# Altium project PCB Robot.PrjPCB
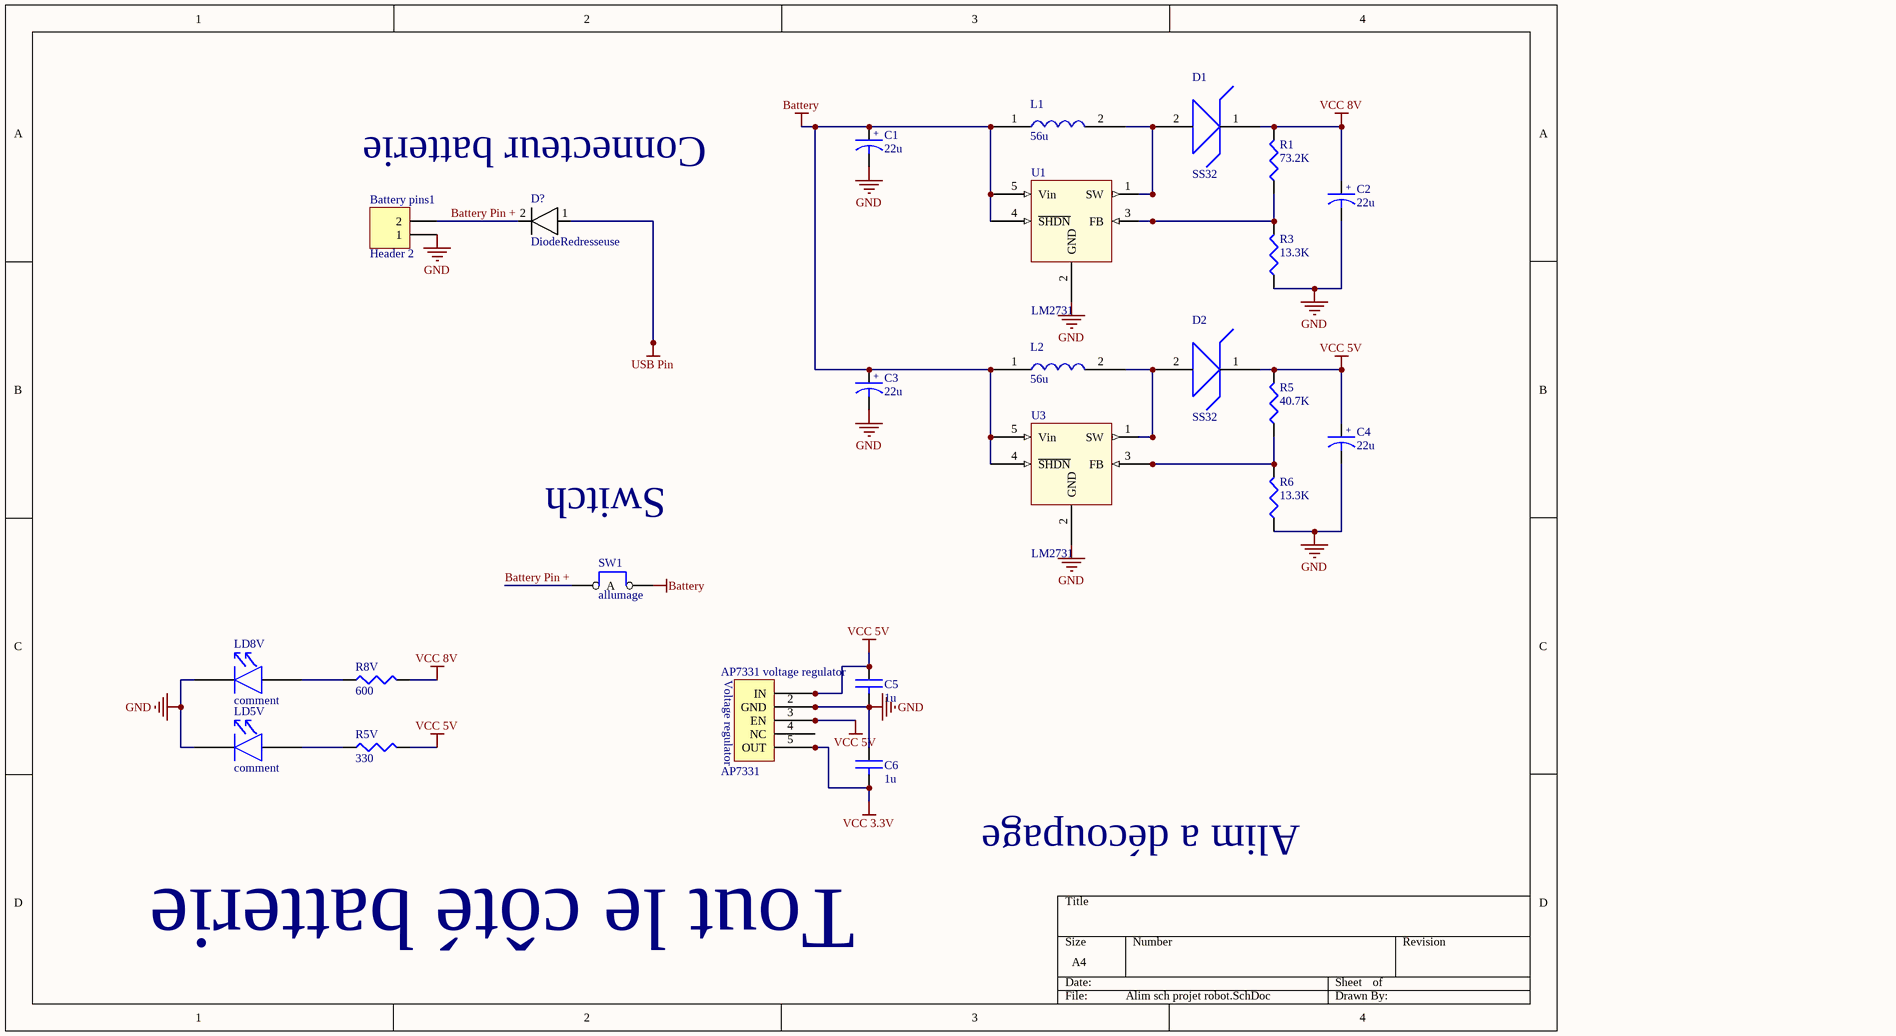
[diagram p0: Alim sch projet robot.SchDoc]
10 sheets, 124 parts. Net scope: flat (ports and power ports of the same name join across sheets).
Board file: PCB robot V3.2.PCBDOC
Sheets:
  Alim sch projet robot.SchDoc
  Schema chargeur USB projet robot.SchDoc
  CarteTxCapteurDistance 2.SchDoc
  CarteTxMoteur.SchDoc
  IA Core.SchDoc
  TXRobot-Boutons.SchDoc
  LED Matrix connector.SchDoc
  Sound Connector.SchDoc
  Wi fi connector.SchDoc
  Line driver connector.SchDoc

## Sheet Alim sch projet robot.SchDoc
size A4; PageSetup: Record=PageOptions|CenterHorizontal=True|CenterVertical=True|PrintScale=1.42|XCorrection=1.00|YCorrection=1.00|PrintKind=0|BorderSize=5000000|LeftOffset=0|BottomOffset=0|Orientation=2|PaperLength=1000|PaperWidth=1000|Scale=100|PaperSource=7|PrintQuality=-4|MediaType=1|DitherType=10|PaperKind=A3|PrintScaleMode=1

### Parts
AP7331_voltage_regulator  AP7331  [AP7331]
Battery_pins1  Header 2  [HDR1X2]
C1  value 22u  [293D/B]  (hidden comment: CAP_POL)
C2  value 22u  [293D/B]  (hidden comment: CAP_POL)
C3  value 22u  [293D/B]  (hidden comment: CAP_POL)
C4  value 22u  [293D/B]  (hidden comment: CAP_POL)
C5  value 1u  [0805]  (hidden comment: CAP)
C6  value 1u  [0805]  (hidden comment: CAP)
D1  SS32  [Schottly Diode SS32 footprint]
D2  SS32  [Schottly Diode SS32 footprint]
D?  DiodeRedresseuse  [Diode MULTICOMP SS16]
L1  value 56u  [1050]  (hidden comment: IND)
L2  value 56u  [1050]  (hidden comment: IND)
LD5V  comment  [LED1206]
LD8V  comment  [LED1206]
R1  value 73.2K  [0805]  (hidden comment: RES)
R3  value 13.3K  [0805]  (hidden comment: RES)
R5  value 40.7K  [0805]  (hidden comment: RES)
R5V  value 330  [0805]  (hidden comment: RES)
R6  value 13.3K  [0805]  (hidden comment: RES)
R8V  value 600  [0805]  (hidden comment: RES)
SW1  allumage  [JMP2-100]
U1  LM2731  [LM2731 footprint]
U3  LM2731  [LM2731 footprint]

### Nets
Battery: C1.1 C3.1 L1.1 L2.1 SW1.2(com) U1.4(~{SHDN}) U1.5(Vin) U3.4(~{SHDN}) U3.5(Vin)
GND: AP7331_voltage_regulator.2(GND) Battery_pins1.1 C1.2 C2.2 C3.2 C4.2 C5.2 C6.1 LD5V.K LD8V.K R3.1 R6.1 U1.2(GND) U3.2(GND)
USB Pin: D?.1
VCC 3.3V: AP7331_voltage_regulator.5(OUT) C6.2
VCC 5V: AP7331_voltage_regulator.1(IN) AP7331_voltage_regulator.3(EN) C4.1 C5.1 D2.1(Cathode_(+)) R5.2 R5V.2
VCC 8V: C2.1 D1.1(Cathode_(+)) R1.2 R8V.2
Battery Pin +: Battery_pins1.2 D?.2 SW1.1(A)
NetD1_2: D1.2(Anode_(-)) L1.2 U1.1(SW)
NetD2_2: D2.2(Anode_(-)) L2.2 U3.1(SW)
NetLD5V_A: LD5V.A R5V.1
NetLD8V_A: LD8V.A R8V.1
NetR1_1: R1.1 R3.2 U1.3(FB)
NetR5_1: R5.1 R6.2 U3.3(FB)

Not connected (* = marked no-connect by the designer): AP7331_voltage_regulator 4(NC)

### Notes on the sheet
- Connecteur batterie
- Switch
- Alim a découpage
- Tout le côté batterie
- (in symbol AP7331) Voltage regulator
- (in symbol CAP_POL) +

### Library data of the parts
Battery_pins1 = Header 2: Header, 2-Pin; LatestRevisionDate: 17-Jul-2002; LatestRevisionNote: Re-released for DXP Platform.; Publisher: Altium Limited
C1-C4 = CAP_POL: capacité polarisée
C5 C6 = CAP: capacité non polarisée
D1 D2 = SS32: Schottky Diode 20V 3A
L1 L2 = Shielded inductor: Shielded Inductor 1050
LD5V LD8V = LED: LED 5mm/3mm/CMS
R1 R3 R5 R5V R6 R8V = RES: resistance
SW1 = JUMPER2: cavalier 1 position
U1 U3 = LM2731: Boost switch regulator DCDC

## Sheet Schema chargeur USB projet robot.SchDoc
size A4; PageSetup: Record=PageOptions|CenterHorizontal=True|CenterVertical=True|PrintScale=1.42|XCorrection=1.00|YCorrection=1.00|PrintKind=0|BorderSize=5000000|LeftOffset=0|BottomOffset=0|Orientation=2|PaperLength=1000|PaperWidth=1000|Scale=100|PaperSource=7|PrintQuality=-4|MediaType=1|DitherType=10|PaperKind=A3|PrintScaleMode=1
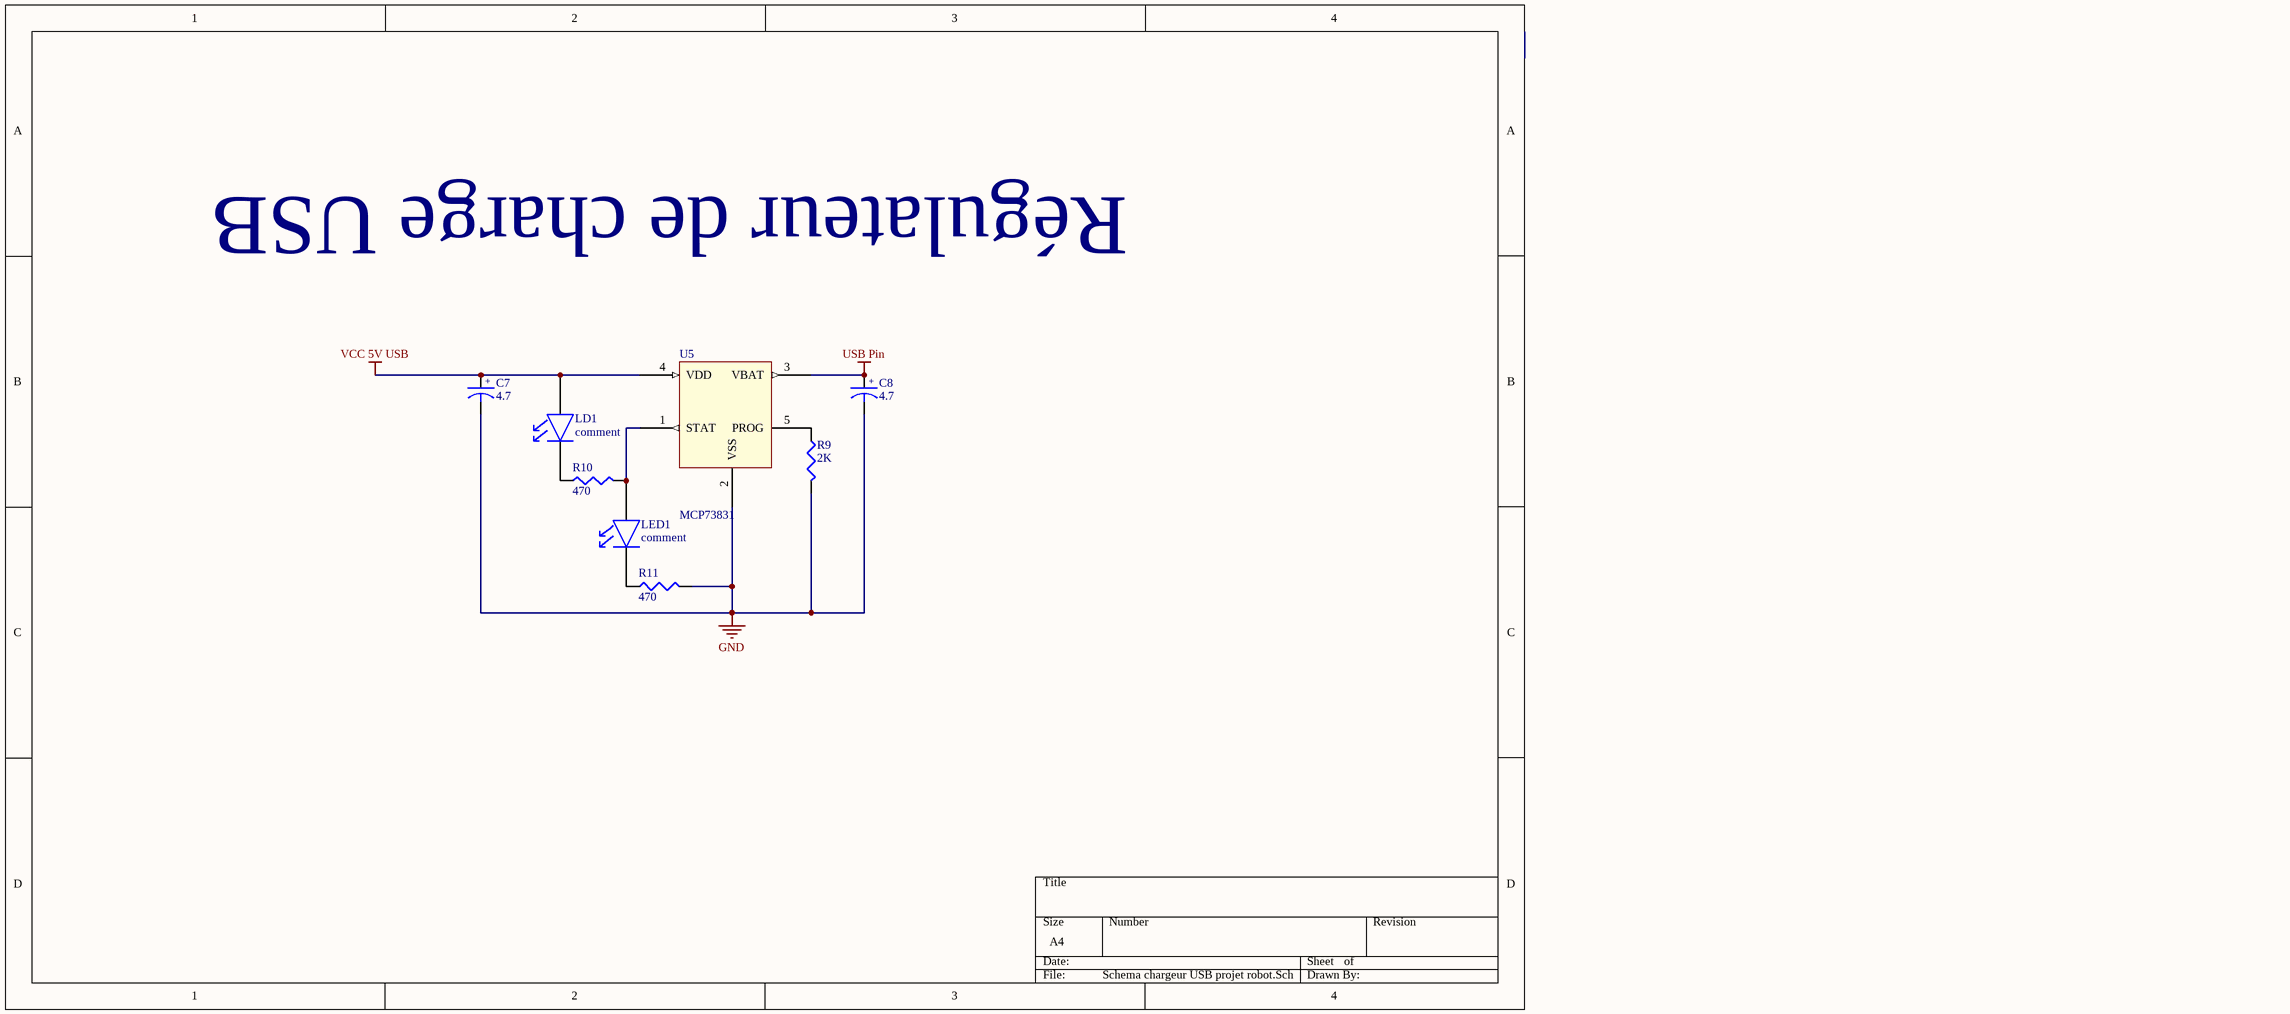
[diagram p1: Schema chargeur USB projet robot.SchDoc]

### Parts
C7  value 4.7  [293D/B]  (hidden comment: CAP_POL)
C8  value 4.7  [293D/B]  (hidden comment: CAP_POL)
LD1  comment  [LED0805]
LED1  comment  [LED0805]
R9  value 2K  [0805]  (hidden comment: RES)
R10  value 470  [0805]  (hidden comment: RES)
R11  value 470  [0805]  (hidden comment: RES)
U5  MCP73831  [MCP73831]

### Nets
GND: C7.2 C8.2 R9.2 R11.2 U5.2(VSS)
USB Pin: C8.1 U5.3(VBAT)
VCC 5V USB: C7.1 LD1.A U5.4(VDD)
NetLD1_K: LD1.K R10.1
NetLED1_A: LED1.A R10.2 U5.1(STAT)
NetLED1_K: LED1.K R11.1
NetR9_1: R9.1 U5.5(PROG)

### Notes on the sheet
- Régulateur de charge USB
- (in symbol CAP_POL) +

### Library data of the parts
C7 C8 = CAP_POL: capacité polarisée
LD1 LED1 = LED: LED 5mm/3mm/CMS
R9-R11 = RES: resistance
U5 = MCP73831: Voltage regulator for Li-po or li-ion battery, USB compatible

## Sheet CarteTxCapteurDistance 2.SchDoc
size A3; PageSetup: Record=PageOptions|CenterHorizontal=True|CenterVertical=True|PrintScale=1.04|XCorrection=1.00|YCorrection=1.00|PrintKind=0|BorderSize=5000000|LeftOffset=0|BottomOffset=0|Orientation=2|PaperLength=1000|PaperWidth=1000|Scale=100|PaperSource=7|PrintQuality=-4|MediaType=1|DitherType=10|PaperKind=A3|PrintScaleMode=1
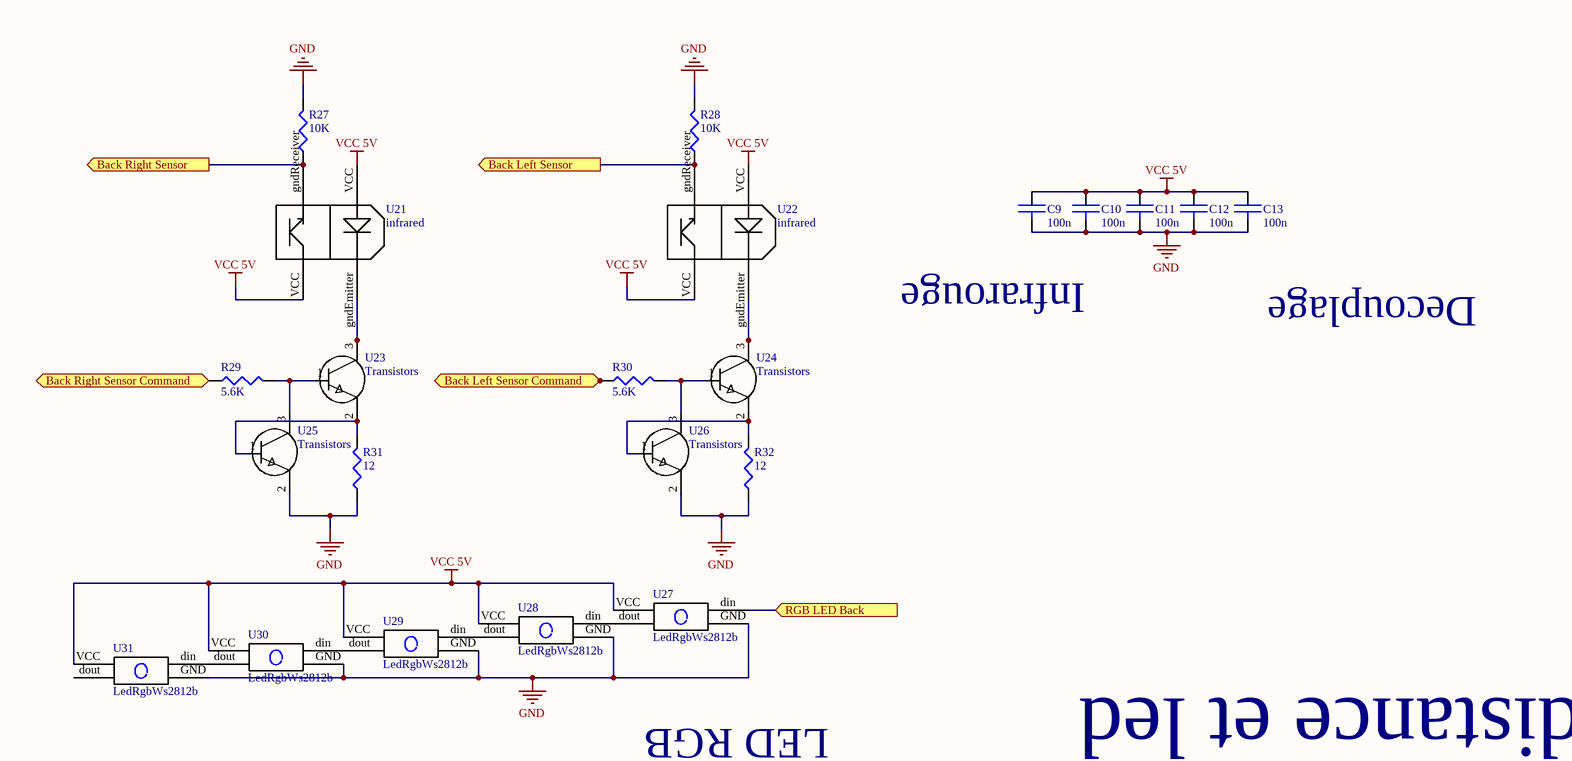
[diagram p2: CarteTxCapteurDistance 2.SchDoc, left]
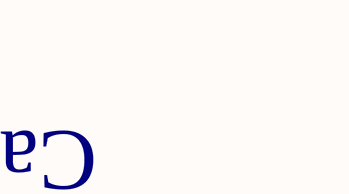
[diagram p3: CarteTxCapteurDistance 2.SchDoc, right]

### Parts
C9  value 100n  [0805]  (hidden comment: CAP)
C10  value 100n  [0805]  (hidden comment: CAP)
C11  value 100n  [0805]  (hidden comment: CAP)
C12  value 100n  [0805]  (hidden comment: CAP)
C13  value 100n  [0805]  (hidden comment: CAP)
R27  value 10K  [0805]  (hidden comment: RES)
R28  value 10K  [0805]  (hidden comment: RES)
R29  value 5.6K  [0805]  (hidden comment: RES)
R30  value 5.6K  [0805]  (hidden comment: RES)
R31  value 12  [0805]  (hidden comment: RES)
R32  value 12  [0805]  (hidden comment: RES)
U21  infrared  [Infrared]
U22  infrared  [Infrared]
U23  Transistors  [BC817-40]
U24  Transistors  [BC817-40]
U25  Transistors  [BC817-40]
U26  Transistors  [BC817-40]
U27  LedRgbWs2812b  [LedRgbWs2812b]
U28  LedRgbWs2812b  [LedRgbWs2812b]
U29  LedRgbWs2812b  [LedRgbWs2812b]
U30  LedRgbWs2812b  [LedRgbWs2812b]
U31  LedRgbWs2812b  [LedRgbWs2812b]

### Ports
Back Left Sensor (out), Back Left Sensor Command (in), Back Right Sensor (out), Back Right Sensor Command (in), RGB LED Back (in)

### Nets
GND: C9.2 C10.2 C11.2 C12.2 C13.2 R27.2 R28.2 R31.1 R32.1 U25.2(Emi) U26.2(Emi) U27.GND U28.GND U29.GND U30.GND U31.GND
VCC 5V: C9.1 C10.1 C11.1 C12.1 C13.1 U21.VCC U22.VCC U27.VCC U28.VCC U29.VCC U30.VCC U31.VCC
NetMicroController1_35: R30.1 ; port Back Left Sensor Command
NetMicroController1_37: R29.1 ; port Back Right Sensor Command
NetMicroController1_40: U27.din ; port RGB LED Back
NetMicroController1_82: R28.1 U22.gndReceiver ; port Back Left Sensor
NetMicroController1_83: R27.1 U21.gndReceiver ; port Back Right Sensor
NetR29_2: R29.2 U23.1(Base) U25.3(Co)
NetR30_2: R30.2 U24.1(Base) U26.3(Co)
NetR31_2: R31.2 U23.2(Emi) U25.1(Base)
NetR32_2: R32.2 U24.2(Emi) U26.1(Base)
NetU21_gndEmitter: U21.gndEmitter U23.3(Co)
NetU22_gndEmitter: U22.gndEmitter U24.3(Co)
NetU27_dout: U27.dout U28.din
NetU28_dout: U28.dout U29.din
NetU29_dout: U29.dout U30.din
NetU30_dout: U30.dout U31.din

Not connected (* = marked no-connect by the designer): U31 dout

### Notes on the sheet
- Infrarouge
- Decouplage
- LED RGB
- Capteur distance et led

### Library data of the parts
C9-C13 = CAP: capacité non polarisée
R27-R32 = RES: resistance
U21 U22 = RPR-359F
U23-U26 = Transistors: NPN transistor

## Sheet CarteTxMoteur.SchDoc
size A4; PageSetup: Record=PageOptions|CenterHorizontal=True|CenterVertical=True|PrintScale=1.42|XCorrection=1.00|YCorrection=1.00|PrintKind=0|BorderSize=5000000|LeftOffset=0|BottomOffset=0|Orientation=2|PaperLength=1000|PaperWidth=1000|Scale=100|PaperSource=7|PrintQuality=-4|MediaType=1|DitherType=10|PaperKind=A3|PrintScaleMode=1
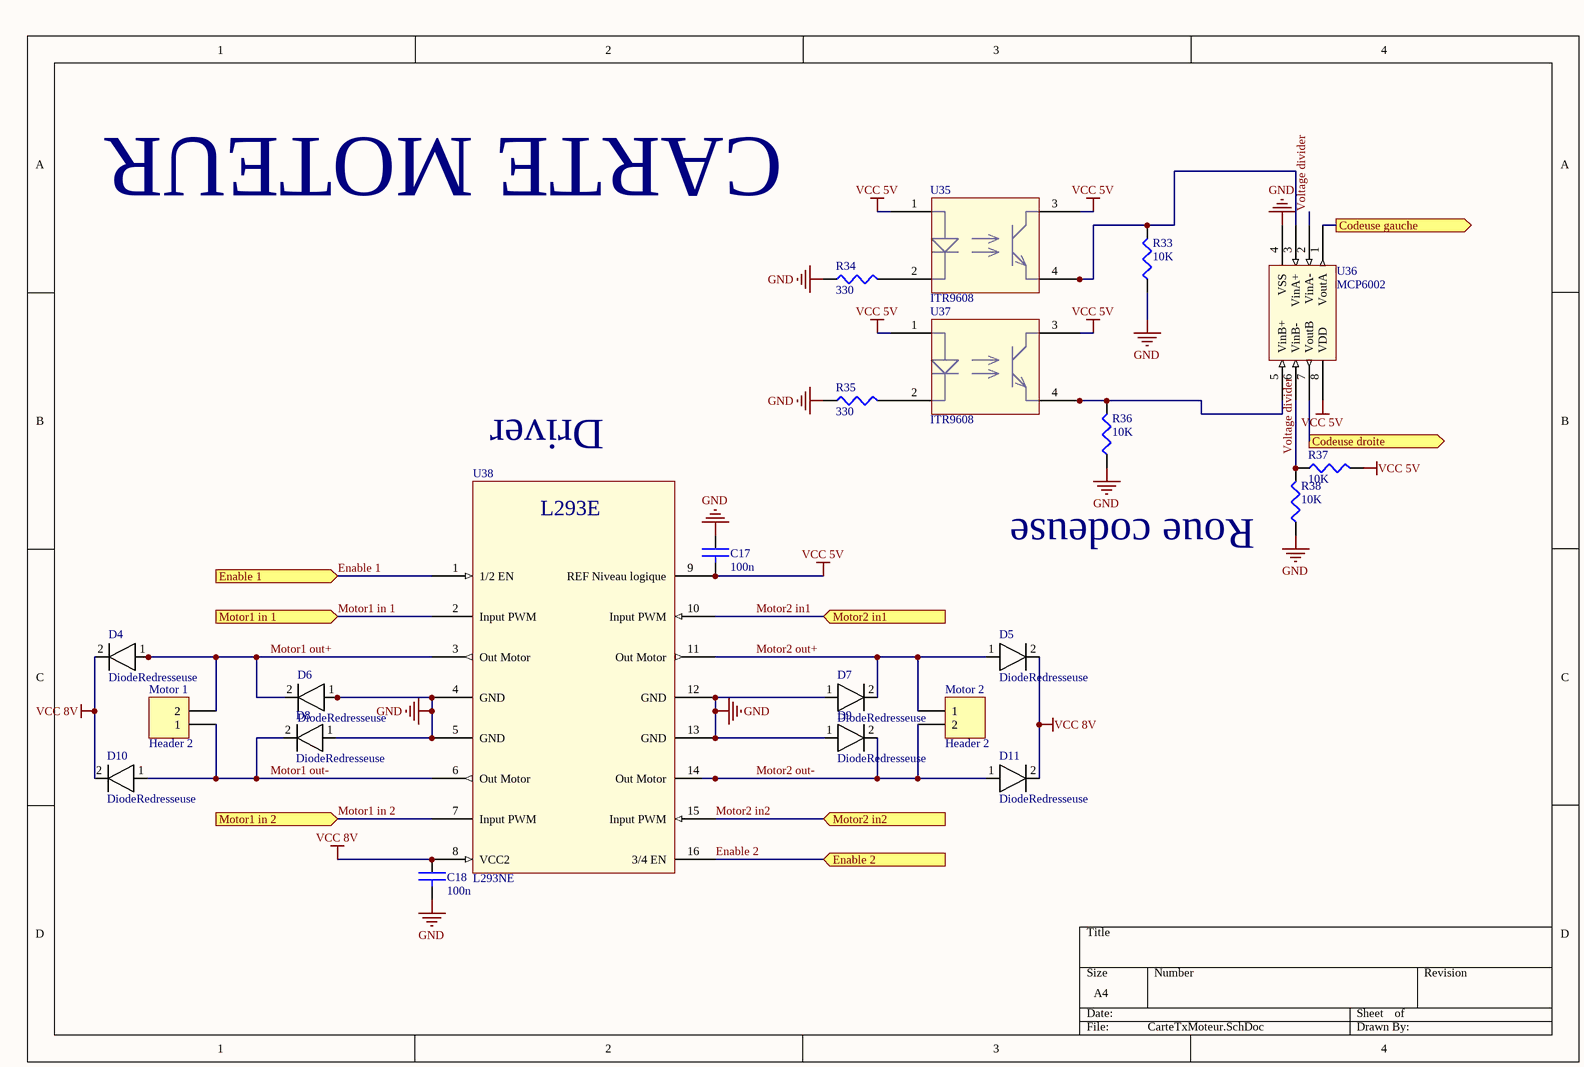
[diagram p4: CarteTxMoteur.SchDoc]

### Parts
C17  value 100n  [0805]  (hidden comment: CAP)
C18  value 100n  [0805]  (hidden comment: CAP)
D4  DiodeRedresseuse  [Diode MULTICOMP SS16]
D5  DiodeRedresseuse  [Diode MULTICOMP SS16]
D6  DiodeRedresseuse  [Diode MULTICOMP SS16]
D7  DiodeRedresseuse  [Diode MULTICOMP SS16]
D8  DiodeRedresseuse  [Diode MULTICOMP SS16]
D9  DiodeRedresseuse  [Diode MULTICOMP SS16]
D10  DiodeRedresseuse  [Diode MULTICOMP SS16]
D11  DiodeRedresseuse  [Diode MULTICOMP SS16]
Motor_1  Header 2  [HDR1X2]
Motor_2  Header 2  [HDR1X2]
R33  value 10K  [0805]  (hidden comment: RES)
R34  value 330  [0805]  (hidden comment: RES)
R35  value 330  [0805]  (hidden comment: RES)
R36  value 10K  [0805]  (hidden comment: RES)
R37  value 10K  [0805]  (hidden comment: RES)
R38  value 10K  [0805]  (hidden comment: RES)
U35  ITR9608  [ITR9608 footprint]
U36  MCP6002  [MCP6002]
U37  ITR9608  [ITR9608 footprint]
U38  L293NE  [L293NE]

### Ports
Codeuse droite (out), Codeuse gauche (out), Enable 1 (in), Enable 2 (in), Motor1 in 1 (in), Motor1 in 2 (in), Motor2 in1 (in), Motor2 in2 (in)

### Nets
GND: C17.1 C18.2 D6.1 D7.1 D8.1 D9.1 R33.1 R34.1 R35.1 R36.1 R38.1 U36.4(VSS) U38.4(GND) U38.5(GND) U38.12(GND) U38.13(GND)
VCC 5V: C17.2 R37.2 U35.1(Ld_Anode) U35.3(Tr_Collector) U36.8(VDD) U37.1(Ld_Anode) U37.3(Tr_Collector) U38.9(REF_Niveau_logique)
VCC 8V: C18.1 D4.2 D5.2 D10.2 D11.2 U38.8(VCC2)
Enable 1: U38.1(1/2_EN) ; port Enable 1
Enable 2: U38.16(3/4_EN) ; port Enable 2
Motor1 in 1: U38.2(Input_PWM) ; port Motor1 in 1
Motor1 in 2: U38.7(Input_PWM) ; port Motor1 in 2
Motor1 out+: D4.1 D6.2 Motor_1.2 U38.3(Out_Motor)
Motor1 out-: D8.2 D10.1 Motor_1.1 U38.6(Out_Motor)
Motor2 in1: U38.10(Input_PWM) ; port Motor2 in1
Motor2 in2: U38.15(Input_PWM) ; port Motor2 in2
Motor2 out+: D5.1 D7.2 Motor_2.1 U38.11(Out_Motor)
Motor2 out-: D9.2 D11.1 Motor_2.2 U38.14(Out_Motor)
Voltage divider: R37.1 R38.2 U36.2(VinA-) U36.6(VinB-)
NetMicroController1_45: U36.7(VoutB) ; port Codeuse droite
NetMicroController1_46: U36.1(VoutA) ; port Codeuse gauche
NetR33_2: R33.2 U35.4(Tr_Emitter) U36.3(VinA+)
NetR34_2: R34.2 U35.2(Ld_Cathode)
NetR35_2: R35.2 U37.2(Ld_Cathode)
NetR36_2: R36.2 U36.5(VinB+) U37.4(Tr_Emitter)

### Notes on the sheet
- CARTE MOTEUR
- Driver
- Roue codeuse
- (in symbol L293NE) L293E

### Library data of the parts
C17 C18 = CAP: capacité non polarisée
Motor_1 Motor_2 = Header 2: Header, 2-Pin; LatestRevisionDate: 17-Jul-2002; LatestRevisionNote: Re-released for DXP Platform.; Publisher: Altium Limited
R33-R38 = RES: resistance
U35 U37 = ITR9608: Intersection sensor
U36 = MCP6002: Double Operational Amplifier

## Sheet IA Core.SchDoc
size A3; PageSetup: Record=PageOptions|CenterHorizontal=True|CenterVertical=True|PrintScale=1.04|XCorrection=1.00|YCorrection=1.00|PrintKind=0|BorderSize=5000000|LeftOffset=0|BottomOffset=0|Orientation=2|PaperLength=1000|PaperWidth=1000|Scale=100|PaperSource=7|PrintQuality=-4|MediaType=1|DitherType=10|PaperKind=A3|PrintScaleMode=1
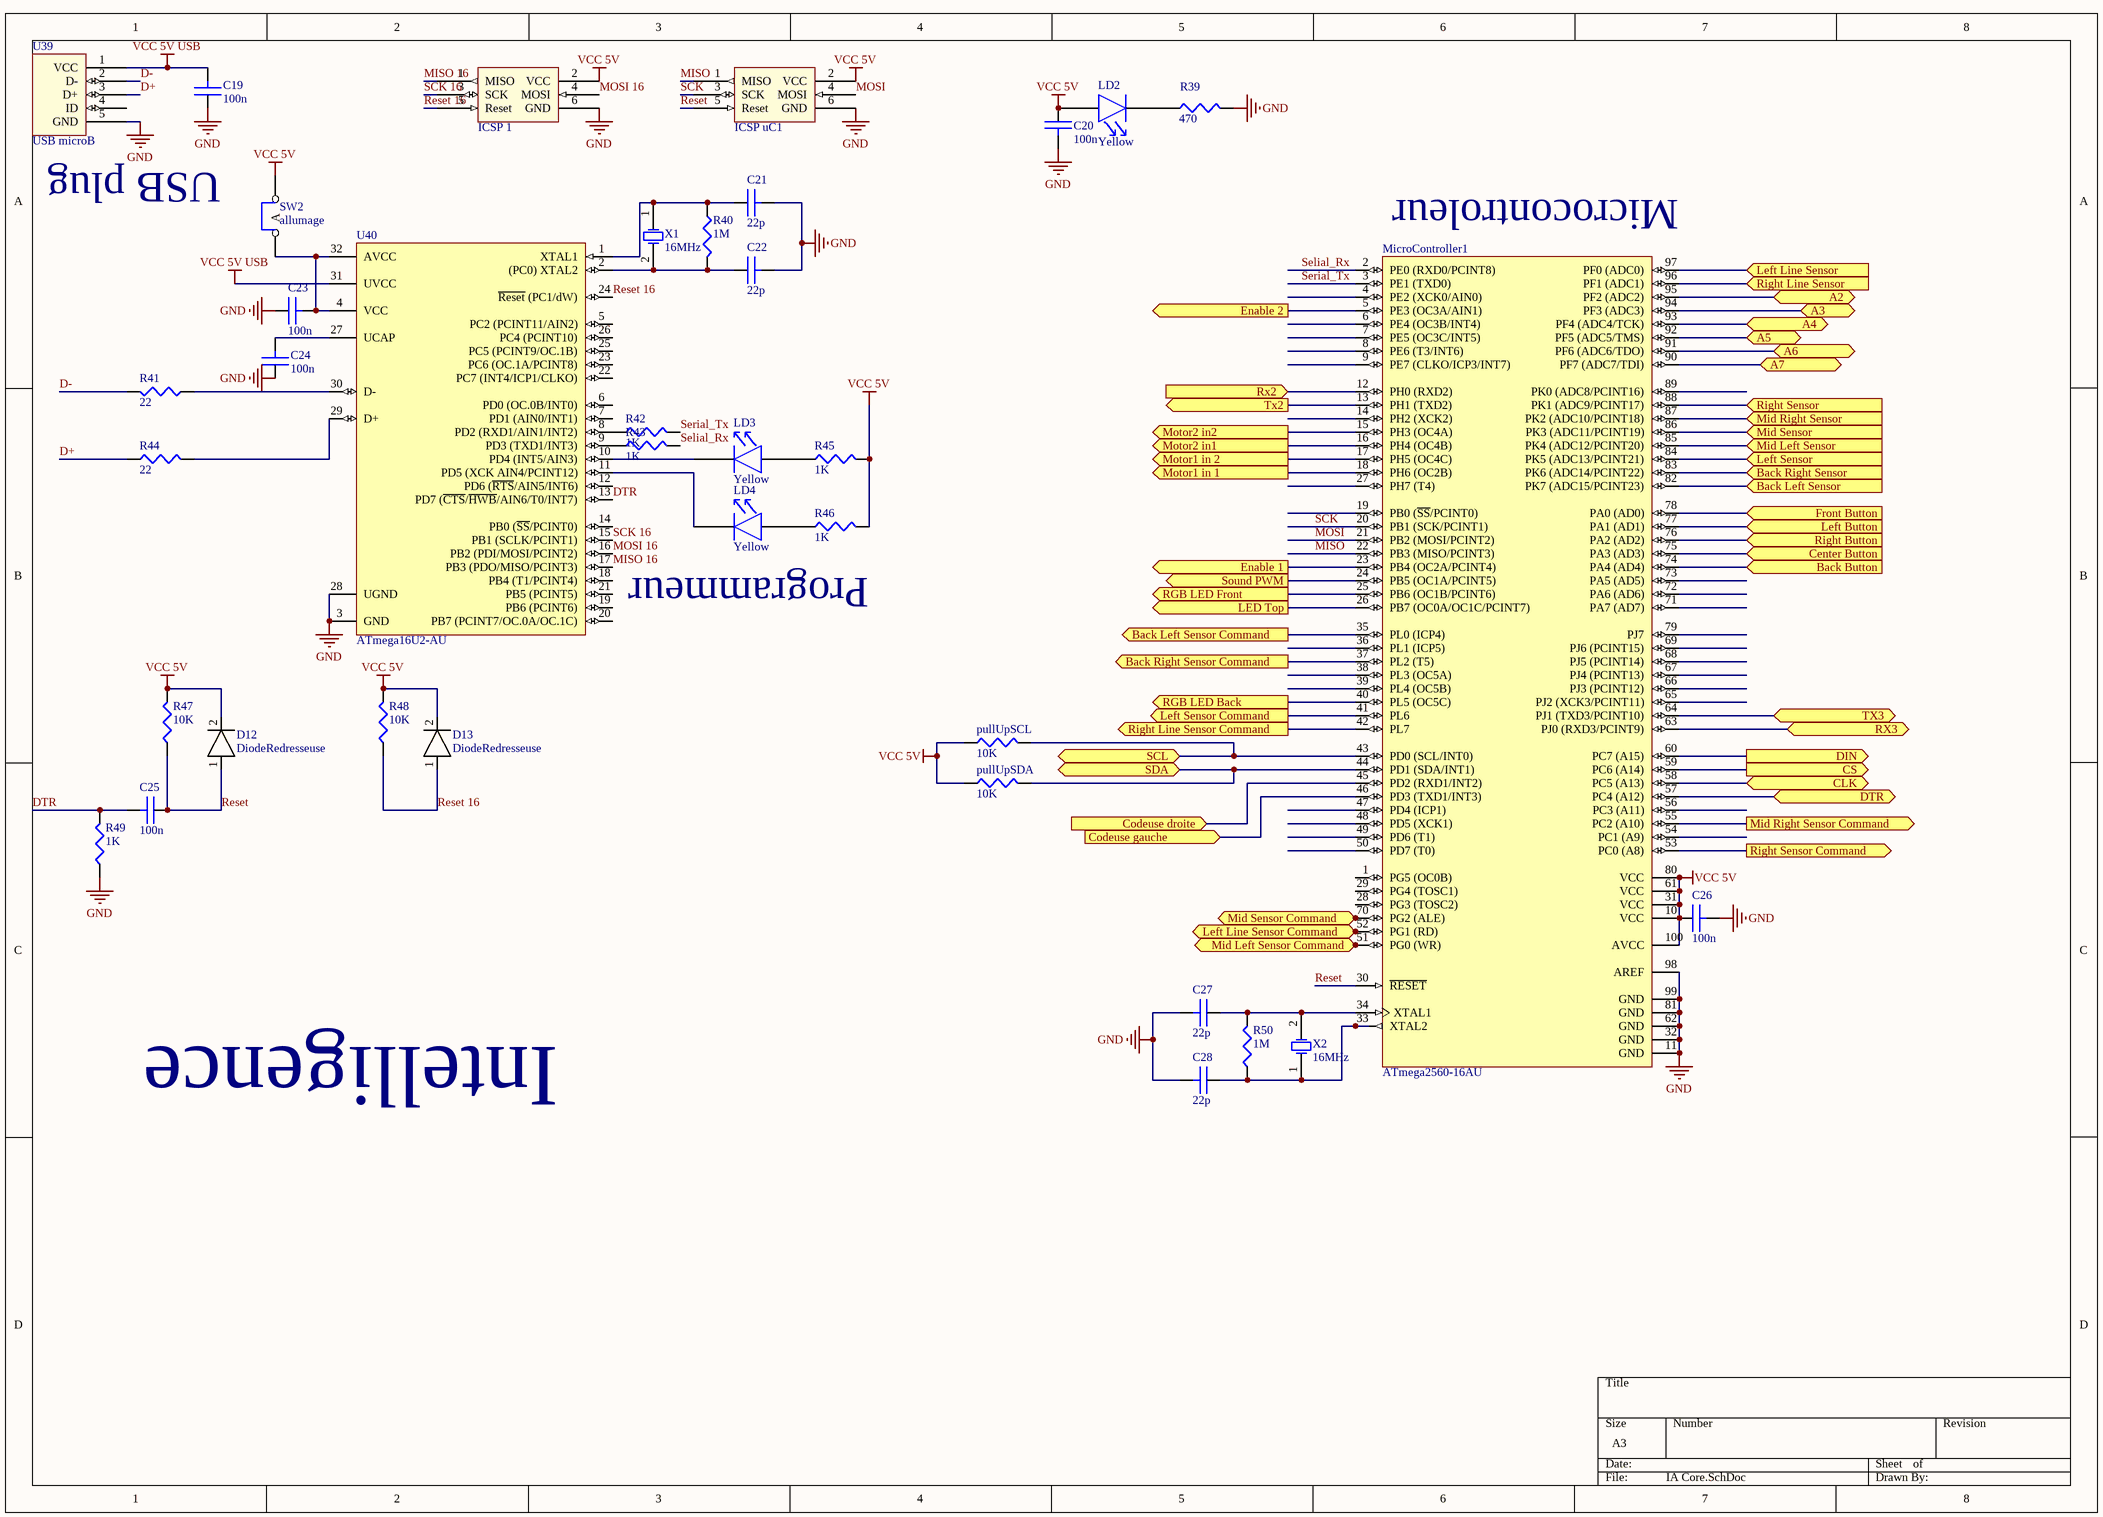
[diagram p5: IA Core.SchDoc]

### Parts
C19  value 100n  [0805]  (hidden comment: CAP)
C20  value 100n  [0805]  (hidden comment: CAP)
C21  value 22p  [0805]  (hidden comment: CAP)
C22  value 22p  [0805]  (hidden comment: CAP)
C23  value 100n  [0805]  (hidden comment: CAP)
C24  value 100n  [0805]  (hidden comment: CAP)
C25  value 100n  [0805]  (hidden comment: CAP)
C26  value 100n  [0805]  (hidden comment: CAP)
C27  value 22p  [0805]  (hidden comment: CAP)
C28  value 22p  [0805]  (hidden comment: CAP)
D12  DiodeRedresseuse  [Diode MULTICOMP SS16]
D13  DiodeRedresseuse  [Diode MULTICOMP SS16]
ICSP_1  ISCP Arduino  [Prog Arduino]  (value not drawn)
ICSP_uC1  ISCP Arduino  [Prog Arduino]  (value not drawn)
LD2  Yellow  [LED0805]
LD3  Yellow  [LED0805]
LD4  Yellow  [LED0805]
MicroController1  ATmega2560-16AU  [100A_N]
pullUpSCL  value 10K  [0805]  (hidden comment: RES)
pullUpSDA  value 10K  [0805]  (hidden comment: RES)
R39  value 470  [0805]  (hidden comment: RES)
R40  value 1M  [0805]  (hidden comment: RES)
R41  value 22  [0805]  (hidden comment: RES)
R42  value 1K  [0805]  (hidden comment: RES)
R43  value 1K  [0805]  (hidden comment: RES)
R44  value 22  [0805]  (hidden comment: RES)
R45  value 1K  [0805]  (hidden comment: RES)
R46  value 1K  [0805]  (hidden comment: RES)
R47  value 10K  [0805]  (hidden comment: RES)
R48  value 10K  [0805]  (hidden comment: RES)
R49  value 1K  [0805]  (hidden comment: RES)
R50  value 1M  [0805]  (hidden comment: RES)
SW2  allumage  [JMP2-100]
U39  USB microB  [USB micro B connector]
U40  ATmega16U2-AU  [32A_N]
X1  16MHz  [HC-49S-SMD]
X2  16MHz  [HC-49S-SMD]

### Ports
A2, A3, A4, A5, A6, A7, Back Button (in), Back Left Sensor (in), Back Left Sensor Command (out), Back Right Sensor (in), Back Right Sensor Command (out), Center Button (in), CLK (bidir), Codeuse droite (in), Codeuse gauche (in), CS (out), DIN (out), DTR (bidir), Enable 1 (out), Enable 2 (out), Front Button (in), LED Top (out), Left Button (in), Left Line Sensor (in), Left Line Sensor Command (out), Left Sensor (in), Left Sensor Command (out), Mid Left Sensor (in), Mid Left Sensor Command (out), Mid Right Sensor (in), Mid Right Sensor Command (out), Mid Sensor (in), Mid Sensor Command (out), Motor1 in 1 (out), Motor1 in 2 (out), Motor2 in1 (out), Motor2 in2 (out), RGB LED Back (out), RGB LED Front (out), Right Button (in), Right Line Sensor (in), Right Line Sensor Command (out), Right Sensor (in), Right Sensor Command (out), Rx2 (in), RX3 (bidir), SCL (bidir), SDA (bidir), Sound PWM (out), Tx2 (out), TX3 (bidir)

### Nets
GND: C19.1 C20.2 C21.2 C22.2 C23.1 C24.1 C26.2 C27.2 C28.2 ICSP_1.6(GND) ICSP_uC1.6(GND) MicroController1.11(GND) MicroController1.32(GND) MicroController1.62(GND) MicroController1.81(GND) MicroController1.98(AREF) MicroController1.99(GND) R39.2 R49.1 U39.5(GND) U39.6 U39.7 U39.8 U39.9 U39.10 U39.11 U40.3(GND) U40.28(UGND)
VCC 5V: C20.1 C26.1 D12.2 D13.2 ICSP_1.2(VCC) ICSP_uC1.2(VCC) LD2.A MicroController1.10(VCC) MicroController1.31(VCC) MicroController1.61(VCC) MicroController1.80(VCC) MicroController1.100(AVCC) pullUpSCL.1 pullUpSDA.1 R45.2 R46.2 R47.2 R48.2 SW2.2(com)
VCC 5V USB: C19.2 U39.1(VCC) U40.31(UVCC)
D+: R44.1 U39.3(D+)
D-: R41.2 U39.2(D-)
DTR: C25.2 R49.2 U40.13(PD7_(~{CTS}/~{HWB}/AIN6/T0/INT7))
Enable 1: MicroController1.23(PB4_(OC2A/PCINT4)) ; port Enable 1
Enable 2: MicroController1.5(PE3_(OC3A/AIN1)) ; port Enable 2
MISO: ICSP_uC1.1(MISO) MicroController1.22(PB3_(MISO/PCINT3))
MISO 16: ICSP_1.1(MISO) U40.17(PB3_(PDO/MISO/PCINT3))
MOSI: ICSP_uC1.4(MOSI) MicroController1.21(PB2_(MOSI/PCINT2))
MOSI 16: ICSP_1.4(MOSI) U40.16(PB2_(PDI/MOSI/PCINT2))
Motor1 in 1: MicroController1.18(PH6_(OC2B)) ; port Motor1 in 1
Motor1 in 2: MicroController1.17(PH5_(OC4C)) ; port Motor1 in 2
Motor2 in1: MicroController1.16(PH4_(OC4B)) ; port Motor2 in1
Motor2 in2: MicroController1.15(PH3_(OC4A)) ; port Motor2 in2
Reset: C25.1 D12.1 ICSP_uC1.5(Reset) MicroController1.30(~{RESET}) R47.1
Reset 16: D13.1 ICSP_1.5(Reset) R48.1 U40.24(~{Reset}_(PC1/dW))
SCK: ICSP_uC1.3(SCK) MicroController1.20(PB1_(SCK/PCINT1))
SCK 16: ICSP_1.3(SCK) U40.15(PB1_(SCLK/PCINT1))
Selial_Rx: MicroController1.2(PE0_(RXD0/PCINT8)) R43.2
Serial_Tx: MicroController1.3(PE1_(TXD0)) R42.2
NetBuzz_0: MicroController1.24(PB5_(OC1A/PCINT5)) ; port Sound PWM
NetC21_1: C21.1 R40.1 U40.1(XTAL1) X1.1(OSC1)
NetC22_1: C22.1 R40.2 U40.2((PC0)_XTAL2) X1.2(OSC2)
NetC23_2: C23.2 SW2.1(A) U40.4(VCC) U40.32(AVCC)
NetC24_2: C24.2 U40.27(UCAP)
NetC27_1: C27.1 MicroController1.34(XTAL1) R50.2 X2.2(OSC2)
NetC28_1: C28.1 MicroController1.33(XTAL2) R50.1 X2.1(OSC1)
NetConnecteur1-10_Left_1: MicroController1.52(PG1_(RD)) ; port Left Line Sensor Command
NetConnecteur1-10_Left_2: MicroController1.88(PK1_(ADC9/PCINT17)) ; port Right Sensor
NetConnecteur1-10_Left_3: MicroController1.97(PF0_(ADC0)) ; port Left Line Sensor
NetConnecteur1-10_Left_4: MicroController1.53(PC0_(A8)) ; port Right Sensor Command
NetConnecteur1-10_Left_5: MicroController1.42(PL7) ; port Right Line Sensor Command
NetConnecteur1-10_Left_7: MicroController1.96(PF1_(ADC1)) ; port Right Line Sensor
NetConnecteur1-10_Left_9: MicroController1.86(PK3_(ADC11/PCINT19)) ; port Mid Sensor
NetConnecteur1-10_Left_10: MicroController1.70(PG2_(ALE)) ; port Mid Sensor Command
NetConnecteur_11-20_Right_1: MicroController1.84(PK5_(ADC13/PCINT21)) ; port Left Sensor
NetConnecteur_11-20_Right_3: MicroController1.41(PL6) ; port Left Sensor Command
NetConnecteur_11-20_Right_5: MicroController1.85(PK4_(ADC12/PCINT20)) ; port Mid Left Sensor
NetConnecteur_11-20_Right_7: MicroController1.51(PG0_(WR)) ; port Mid Left Sensor Command
NetConnecteur_11-20_Right_8: MicroController1.25(PB6_(OC1B/PCINT6)) ; port RGB LED Front
NetConnecteur_11-20_Right_9: MicroController1.87(PK2_(ADC10/PCINT18)) ; port Mid Right Sensor
NetConnecteur_11-20_Right_10: MicroController1.55(PC2_(A10)) ; port Mid Right Sensor Command
NetLD2_K: LD2.K R39.1
NetLD3_A: LD3.A R45.1
NetLD3_K: LD3.K U40.10(PD4_(INT5/AIN3))
NetLD4_A: LD4.A R46.1
NetLD4_K: LD4.K U40.11(PD5_(XCK_AIN4/PCINT12))
NetMicroController1_12: MicroController1.12(PH0_(RXD2)) ; port Rx2
NetMicroController1_13: MicroController1.13(PH1_(TXD2)) ; port Tx2
NetMicroController1_26: MicroController1.26(PB7_(OC0A/OC1C/PCINT7)) ; port LED Top
NetMicroController1_35: MicroController1.35(PL0_(ICP4)) ; port Back Left Sensor Command
NetMicroController1_37: MicroController1.37(PL2_(T5)) ; port Back Right Sensor Command
NetMicroController1_40: MicroController1.40(PL5_(OC5C)) ; port RGB LED Back
NetMicroController1_43: MicroController1.43(PD0_(SCL/INT0)) pullUpSCL.2 ; port SCL
NetMicroController1_44: MicroController1.44(PD1_(SDA/INT1)) pullUpSDA.2 ; port SDA
NetMicroController1_45: MicroController1.45(PD2_(RXD1/INT2)) ; port Codeuse droite
NetMicroController1_46: MicroController1.46(PD3_(TXD1/INT3)) ; port Codeuse gauche
NetMicroController1_57: MicroController1.57(PC4_(A12)) ; port DTR
NetMicroController1_58: MicroController1.58(PC5_(A13)) ; port CLK
NetMicroController1_59: MicroController1.59(PC6_(A14)) ; port CS
NetMicroController1_60: MicroController1.60(PC7_(A15)) ; port DIN
NetMicroController1_63: MicroController1.63(PJ0_(RXD3/PCINT9)) ; port RX3
NetMicroController1_64: MicroController1.64(PJ1_(TXD3/PCINT10)) ; port TX3
NetMicroController1_74: MicroController1.74(PA4_(AD4)) ; port Back Button
NetMicroController1_75: MicroController1.75(PA3_(AD3)) ; port Center Button
NetMicroController1_76: MicroController1.76(PA2_(AD2)) ; port Right Button
NetMicroController1_77: MicroController1.77(PA1_(AD1)) ; port Left Button
NetMicroController1_78: MicroController1.78(PA0_(AD0)) ; port Front Button
NetMicroController1_82: MicroController1.82(PK7_(ADC15/PCINT23)) ; port Back Left Sensor
NetMicroController1_83: MicroController1.83(PK6_(ADC14/PCINT22)) ; port Back Right Sensor
NetMicroController1_90: MicroController1.90(PF7_(ADC7/TDI)) ; port A7
NetMicroController1_91: MicroController1.91(PF6_(ADC6/TDO)) ; port A6
NetMicroController1_92: MicroController1.92(PF5_(ADC5/TMS)) ; port A5
NetMicroController1_93: MicroController1.93(PF4_(ADC4/TCK)) ; port A4
NetMicroController1_94: MicroController1.94(PF3_(ADC3)) ; port A3
NetMicroController1_95: MicroController1.95(PF2_(ADC2)) ; port A2
NetR41_1: R41.1 U40.30(D-)
NetR42_1: R42.1 U40.8(PD2_(RXD1/AIN1/INT2))
NetR43_1: R43.1 U40.9(PD3_(TXD1/INT3))
NetR44_2: R44.2 U40.29(D+)

Not connected (* = marked no-connect by the designer): MicroController1 1(PG5_(OC0B)) 4(PE2_(XCK0/AIN0)) 6(PE4_(OC3B/INT4)) 7(PE5_(OC3C/INT5)) 8(PE6_(T3/INT6)) 9(PE7_(CLKO/ICP3/INT7)) 14(PH2_(XCK2)) 19(PB0_(~{SS}/PCINT0)) 27(PH7_(T4)) 28(PG3_(TOSC2)) 29(PG4_(TOSC1)) 36(PL1_(ICP5)) 38(PL3_(OC5A)) 39(PL4_(OC5B)) 47(PD4_(ICP1)) 48(PD5_(XCK1)) 49(PD6_(T1)) 50(PD7_(T0)) 54(PC1_(A9)) 56(PC3_(A11)) 65(PJ2_(XCK3/PCINT11)) 66(PJ3_(PCINT12)) 67(PJ4_(PCINT13)) 68(PJ5_(PCINT14)) 69(PJ6_(PCINT15)) 71(PA7_(AD7)) 72(PA6_(AD6)) 73(PA5_(AD5)) 79(PJ7) 89(PK0_(ADC8/PCINT16)); U39 4(ID); U40 5(PC2_(PCINT11/AIN2)) 6(PD0_(OC.0B/INT0)) 7(PD1_(AIN0/INT1)) 12(PD6_(~{RTS}/AIN5/INT6)) 14(PB0_(~{SS}/PCINT0)) 18(PB4_(T1/PCINT4)) 19(PB6_(PCINT6)) 20(PB7_(PCINT7/OC.0A/OC.1C)) 21(PB5_(PCINT5)) 22(PC7_(INT4/ICP1/CLKO)) 23(PC6_(OC.1A/PCINT8)) 25(PC5_(PCINT9/OC.1B)) 26(PC4_(PCINT10))

### Notes on the sheet
- USB plug
- (near MicroController1) Microcontroleur
- Programmeur
- Intelligence

### Library data of the parts
C19-C28 = CAP: capacité non polarisée
ICSP_1 ICSP_uC1 = ISCP Arduino: Programmation Port For Arduino
LD2-LD4 = LED: LED 5mm/3mm/CMS
MicroController1 = ATmega2560-16AU: 8-bit AVR Microcontroller, 4.5-5.5V, 256KB Flash, 4KB EEPROM, 8KB SRAM, 86 GPIO pins, 100-pin TQFP, Industrial Grade (-40°C to 85°C), Pb-Free; Published: 1-Apr-2010; DatasheetVersion: revL, Aug-2007; PackageVersion: revC, Oct-2001; PackageReference: 100A; Publisher: Altium Limited; PackageDescription: 100-Pin Thin Profile Plastic Quad Flat Pack (TQFP), 14 x 14 x 1.0 mm Body, 0.5 mm Pitch; Supplier 1: Digi-Key; Supplier Part Number 1: ATMEGA2560-16AU-ND; Supplier 2: Farnell; Supplier Part Number 2: 1288330; Supplier 3: Farnell; Supplier Part Number 3: 1661740; Supplier 4: Mouser; Supplier Part Number 4: 556-ATMEGA2560-16AU; Code_JEDEC: MS-026-AED; ComponentLink1Description: Manufacturer Link; ComponentLink1URL: http://www.atmel.com/products/avr/default.asp?; ComponentLink2Description: ATmega640/1280/1281/2560/2561 Datasheet; ComponentLink2URL: http://www.atmel.com/dyn/resources/prod_documents/doc2549.pdf; ComponentLink3Description: ATmega640/1280/1281/2560/2561 Summary; ComponentLink3URL: http://www.atmel.com/dyn/resources/prod_documents/2549S.pdf; ComponentLink4Description: Atmel.com Home; ComponentLink4URL: http://www.atmel.com
pullUpSCL pullUpSDA R39-R50 = RES: resistance
SW2 = JUMPER2: cavalier 1 position
U39 = USB microB: Usb female connector SMD micro B
U40 = ATmega16U2-AU: 8-bit AVR Microcontroller, 2.7-5.5V, 16KB Flash, 512 Bytes EEPROM, 512 Bytes SRAM, 32-pin TQFP, Industrial Grade (-40°C to 85°C); Published: 1-Apr-2010; DatasheetVersion: revC, Dec-2009; PackageVersion: revB, Oct-2001; PackageReference: 32A; Publisher: Altium Limited; PackageDescription: 32-Lead, 7x7x1.0 mm Body, 0.8mm Lead Pitch, Thin Profile Plastic Quad Flat Package (TQFP); Supplier 1: Digi-Key; Supplier Part Number 1: ATMEGA16U2-AU-ND; Supplier 2: Mouser; Supplier Part Number 2: 556-ATMEGA16U2-AU; Code_JEDEC: MS-026-ABA; ComponentLink1Description: Manufacturer Link; ComponentLink1URL: http://www.atmel.com/products/avr/default.asp?; ComponentLink2Description: ATmega8U2/16U2/32U2 Datasheet; ComponentLink2URL: http://www.atmel.com/dyn/resources/prod_documents/doc7799.pdf; ComponentLink3Description: ATmega8U2/16U2/32U2 Summary; ComponentLink3URL: http://www.atmel.com/dyn/resources/prod_documents/7799S.pdf; ComponentLink4Description: Atmel.com Home; ComponentLink4URL: http://www.atmel.com
X1 X2 = XTAL: Quartz; Manufacturer: Generic Components; Class I: Oscillator; Class II: Crystal Oscillator; Published: 8-Jun-2000; Revision: July-2002: Re-released for DXP Platform.; Publisher: Altium Limited

## Sheet TXRobot-Boutons.SchDoc
size A4; PageSetup: Record=PageOptions|CenterHorizontal=True|CenterVertical=True|PrintScale=1.00|XCorrection=1.00|YCorrection=1.00|PrintKind=1|BorderSize=5000000|LeftOffset=0|BottomOffset=0|Orientation=2|PaperLength=2970|PaperWidth=2100|Scale=100|PaperSource=7|PrintQuality=1200|MediaType=1|DitherType=10|PaperKind=A4|PrintScaleMode=1
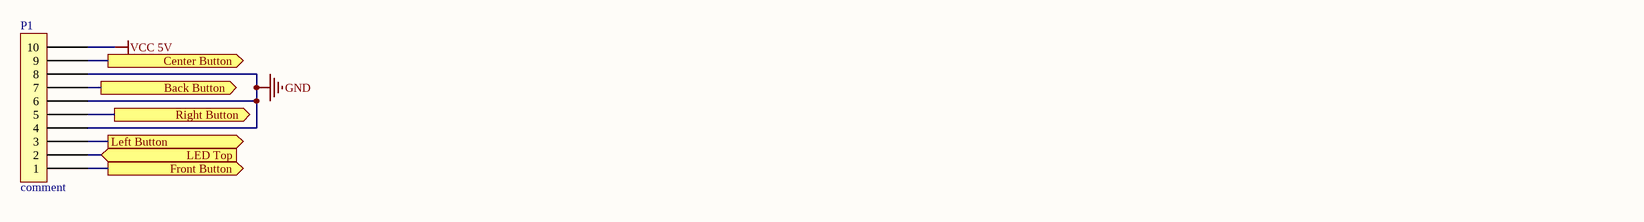
[diagram p6: TXRobot-Boutons.SchDoc]

### Parts
P1  comment  [HE10-10V]

### Ports
Back Button (out), Center Button (out), Front Button (out), LED Top (in), Left Button (out), Right Button (out)

### Nets
GND: P1.4 P1.6 P1.8
VCC 5V: P1.10
NetMicroController1_26: P1.2 ; port LED Top
NetMicroController1_74: P1.7 ; port Back Button
NetMicroController1_75: P1.9 ; port Center Button
NetMicroController1_76: P1.5 ; port Right Button
NetMicroController1_77: P1.3 ; port Left Button
NetMicroController1_78: P1.1 ; port Front Button

### Notes on the sheet
- (near P1) Connecteur carte bouton

### Library data of the parts
P1 = HE10-10: 10-pin connector

## Sheet LED Matrix connector.SchDoc
size A4
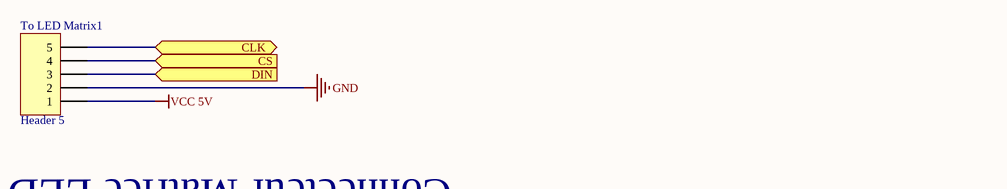
[diagram p7: LED Matrix connector.SchDoc]

### Parts
To_LED_Matrix1  Header 5  [HDR1X5]

### Ports
CLK (bidir), CS (in), DIN (in)

### Nets
GND: To_LED_Matrix1.2
VCC 5V: To_LED_Matrix1.1
NetMicroController1_58: To_LED_Matrix1.5 ; port CLK
NetMicroController1_59: To_LED_Matrix1.4 ; port CS
NetMicroController1_60: To_LED_Matrix1.3 ; port DIN

### Notes on the sheet
- Connecteur Matrice LED

### Library data of the parts
To_LED_Matrix1 = Header 5: Header, 5-Pin; LatestRevisionDate: 17-Jul-2002; LatestRevisionNote: Re-released for DXP Platform.; Publisher: Altium Limited

## Sheet Sound Connector.SchDoc
size A4
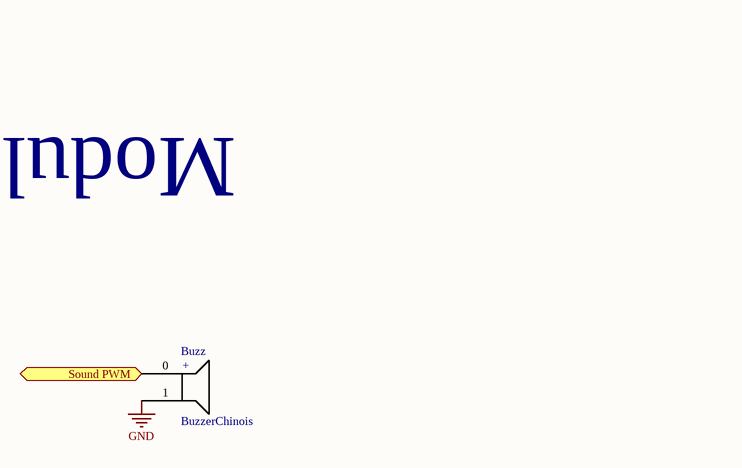
[diagram p8: Sound Connector.SchDoc]

### Parts
Buzz  BuzzerChinois  [BuzzerChinois]

### Ports
Sound PWM (in)

### Nets
GND: Buzz.1(Moins)
NetBuzz_0: Buzz.0(Plus) ; port Sound PWM

### Notes on the sheet
- Module son
- (in symbol BuzzerChinois) +

## Sheet Wi fi connector.SchDoc
size A4
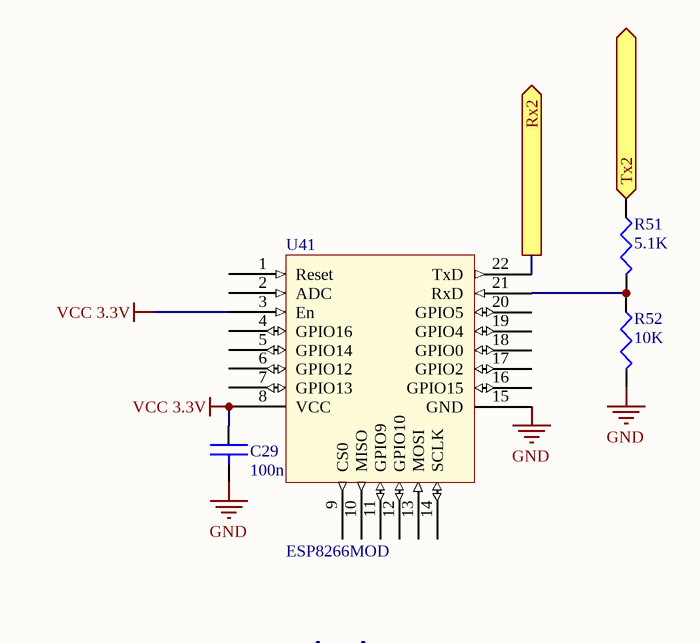
[diagram p9: Wi fi connector.SchDoc]

### Parts
C29  value 100n  [0805]  (hidden comment: CAP)
R51  value 5.1K  [0805]  (hidden comment: RES)
R52  value 10K  [0805]  (hidden comment: RES)
U41  ESP8266MOD  [ESP8266MOD Footprint]

### Ports
Rx2 (out), Tx2 (in)

### Nets
GND: C29.2 R52.2 U41.15(GND)
VCC 3.3V: C29.1 U41.3(En) U41.8(VCC)
NetMicroController1_12: U41.22(TxD) ; port Rx2
NetMicroController1_13: R51.1 ; port Tx2
NetR51_2: R51.2 R52.1 U41.21(RxD)

Not connected (* = marked no-connect by the designer): U41 1(Reset) 2(ADC) 4(GPIO16) 5(GPIO14) 6(GPIO12) 7(GPIO13) 9(CS0) 10(MISO) 11(GPIO9) 12(GPIO10) 13(MOSI) 14(SCLK) 16(GPIO15) 17(GPIO2) 18(GPIO0) 19(GPIO4) 20(GPIO5)

### Notes on the sheet
- WIFI

### Library data of the parts
C29 = CAP: capacité non polarisée
R51 R52 = RES: resistance
U41 = ESP8266MOD: Wi fi ESP

## Sheet Line driver connector.SchDoc
size A4
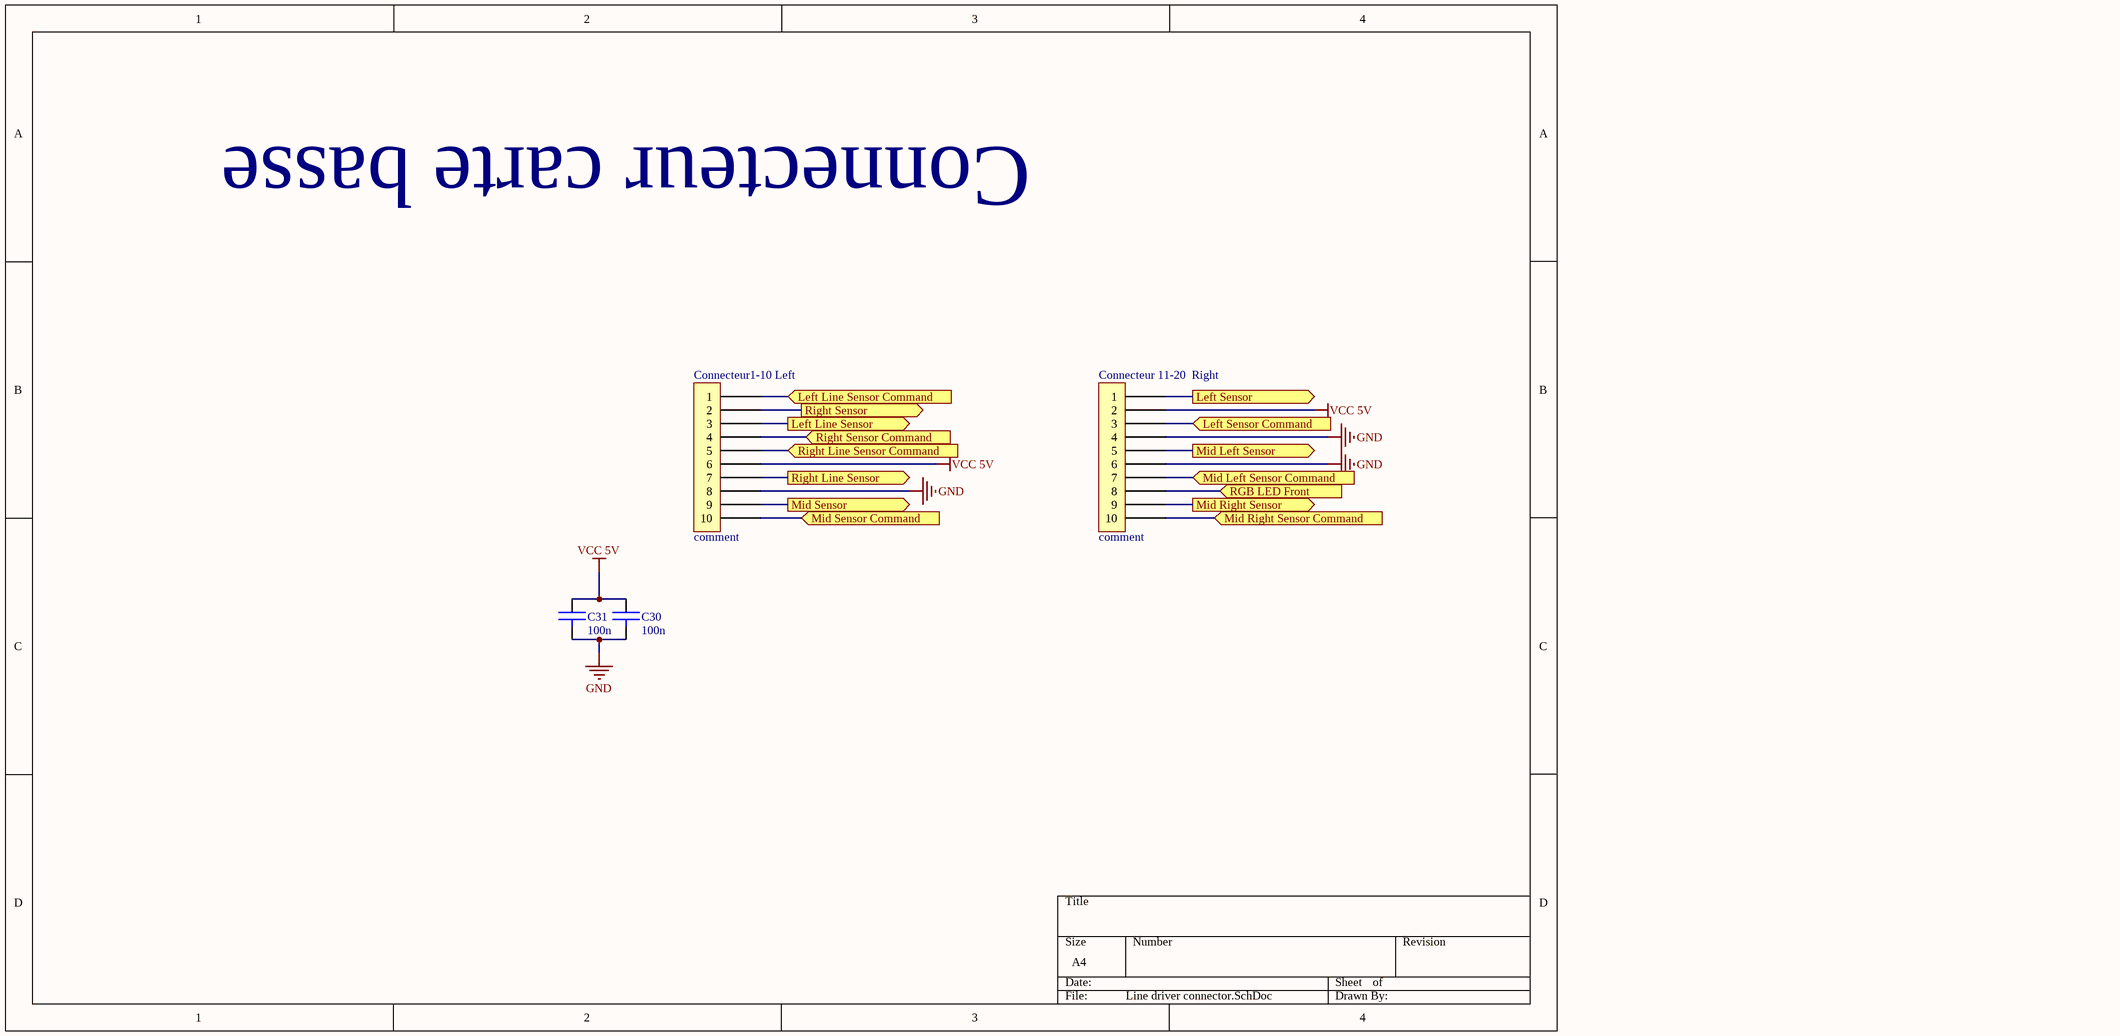
[diagram p10: Line driver connector.SchDoc]

### Parts
C30  value 100n  [0805]  (hidden comment: CAP)
C31  value 100n  [0805]  (hidden comment: CAP)
Connecteur1-10_Left  comment  [HE10-10V]
Connecteur_11-20_Right  comment  [HE10-10V]

### Ports
Left Line Sensor (out), Left Line Sensor Command (in), Left Sensor (out), Left Sensor Command (in), Mid Left Sensor (out), Mid Left Sensor Command (in), Mid Right Sensor (out), Mid Right Sensor Command (in), Mid Sensor (out), Mid Sensor Command (in), RGB LED Front (in), Right Line Sensor (out), Right Line Sensor Command (in), Right Sensor (out), Right Sensor Command (in)

### Nets
GND: C30.2 C31.2 Connecteur1-10_Left.8 Connecteur_11-20_Right.4 Connecteur_11-20_Right.6
VCC 5V: C30.1 C31.1 Connecteur1-10_Left.6 Connecteur_11-20_Right.2
NetConnecteur1-10_Left_1: Connecteur1-10_Left.1 ; port Left Line Sensor Command
NetConnecteur1-10_Left_2: Connecteur1-10_Left.2 ; port Right Sensor
NetConnecteur1-10_Left_3: Connecteur1-10_Left.3 ; port Left Line Sensor
NetConnecteur1-10_Left_4: Connecteur1-10_Left.4 ; port Right Sensor Command
NetConnecteur1-10_Left_5: Connecteur1-10_Left.5 ; port Right Line Sensor Command
NetConnecteur1-10_Left_7: Connecteur1-10_Left.7 ; port Right Line Sensor
NetConnecteur1-10_Left_9: Connecteur1-10_Left.9 ; port Mid Sensor
NetConnecteur1-10_Left_10: Connecteur1-10_Left.10 ; port Mid Sensor Command
NetConnecteur_11-20_Right_1: Connecteur_11-20_Right.1 ; port Left Sensor
NetConnecteur_11-20_Right_3: Connecteur_11-20_Right.3 ; port Left Sensor Command
NetConnecteur_11-20_Right_5: Connecteur_11-20_Right.5 ; port Mid Left Sensor
NetConnecteur_11-20_Right_7: Connecteur_11-20_Right.7 ; port Mid Left Sensor Command
NetConnecteur_11-20_Right_8: Connecteur_11-20_Right.8 ; port RGB LED Front
NetConnecteur_11-20_Right_9: Connecteur_11-20_Right.9 ; port Mid Right Sensor
NetConnecteur_11-20_Right_10: Connecteur_11-20_Right.10 ; port Mid Right Sensor Command

### Notes on the sheet
- Connecteur carte basse

### Library data of the parts
C30 C31 = CAP: capacité non polarisée
Connecteur1-10_Left Connecteur_11-20_Right = HE10-10: 10-pin connector

## Nets that join several sheets
GND: Alim sch projet robot (14 pins), Schema chargeur USB projet robot (5 pins), CarteTxCapteurDistance 2 (16 pins), CarteTxMoteur (16 pins), IA Core (28 pins), TXRobot-Boutons (P1.4 P1.6 P1.8), LED Matrix connector (To_LED_Matrix1.2), Sound Connector (Buzz.1), Wi fi connector (C29.2 R52.2 U41.15), Line driver connector (5 pins)
USB Pin: Alim sch projet robot (D?.1), Schema chargeur USB projet robot (C8.1 U5.3)
VCC 3.3V: Alim sch projet robot (AP7331_voltage_regulator.5 C6.2), Wi fi connector (C29.1 U41.3 U41.8)
VCC 5V: Alim sch projet robot (7 pins), CarteTxCapteurDistance 2 (12 pins), CarteTxMoteur (8 pins), IA Core (19 pins), TXRobot-Boutons (P1.10), LED Matrix connector (To_LED_Matrix1.1), Line driver connector (C30.1 C31.1 Connecteur1-10_Left.6 Connecteur_11-20_Right.2)
VCC 5V USB: Schema chargeur USB projet robot (C7.1 LD1.A U5.4), IA Core (C19.2 U39.1 U40.31)
VCC 8V: Alim sch projet robot (C2.1 D1.1 R1.2 R8V.2), CarteTxMoteur (6 pins)
Enable 1: CarteTxMoteur (U38.1), IA Core (MicroController1.23)
Enable 2: CarteTxMoteur (U38.16), IA Core (MicroController1.5)
Motor1 in 1: CarteTxMoteur (U38.2), IA Core (MicroController1.18)
Motor1 in 2: CarteTxMoteur (U38.7), IA Core (MicroController1.17)
Motor2 in1: CarteTxMoteur (U38.10), IA Core (MicroController1.16)
Motor2 in2: CarteTxMoteur (U38.15), IA Core (MicroController1.15)
NetBuzz_0: IA Core (MicroController1.24), Sound Connector (Buzz.0)
NetConnecteur1-10_Left_1: IA Core (MicroController1.52), Line driver connector (Connecteur1-10_Left.1)
NetConnecteur1-10_Left_2: IA Core (MicroController1.88), Line driver connector (Connecteur1-10_Left.2)
NetConnecteur1-10_Left_3: IA Core (MicroController1.97), Line driver connector (Connecteur1-10_Left.3)
NetConnecteur1-10_Left_4: IA Core (MicroController1.53), Line driver connector (Connecteur1-10_Left.4)
NetConnecteur1-10_Left_5: IA Core (MicroController1.42), Line driver connector (Connecteur1-10_Left.5)
NetConnecteur1-10_Left_7: IA Core (MicroController1.96), Line driver connector (Connecteur1-10_Left.7)
NetConnecteur1-10_Left_9: IA Core (MicroController1.86), Line driver connector (Connecteur1-10_Left.9)
NetConnecteur1-10_Left_10: IA Core (MicroController1.70), Line driver connector (Connecteur1-10_Left.10)
NetConnecteur_11-20_Right_1: IA Core (MicroController1.84), Line driver connector (Connecteur_11-20_Right.1)
NetConnecteur_11-20_Right_3: IA Core (MicroController1.41), Line driver connector (Connecteur_11-20_Right.3)
NetConnecteur_11-20_Right_5: IA Core (MicroController1.85), Line driver connector (Connecteur_11-20_Right.5)
NetConnecteur_11-20_Right_7: IA Core (MicroController1.51), Line driver connector (Connecteur_11-20_Right.7)
NetConnecteur_11-20_Right_8: IA Core (MicroController1.25), Line driver connector (Connecteur_11-20_Right.8)
NetConnecteur_11-20_Right_9: IA Core (MicroController1.87), Line driver connector (Connecteur_11-20_Right.9)
NetConnecteur_11-20_Right_10: IA Core (MicroController1.55), Line driver connector (Connecteur_11-20_Right.10)
NetMicroController1_12: IA Core (MicroController1.12), Wi fi connector (U41.22)
NetMicroController1_13: IA Core (MicroController1.13), Wi fi connector (R51.1)
NetMicroController1_26: IA Core (MicroController1.26), TXRobot-Boutons (P1.2)
NetMicroController1_35: CarteTxCapteurDistance 2 (R30.1), IA Core (MicroController1.35)
NetMicroController1_37: CarteTxCapteurDistance 2 (R29.1), IA Core (MicroController1.37)
NetMicroController1_40: CarteTxCapteurDistance 2 (U27.din), IA Core (MicroController1.40)
NetMicroController1_45: CarteTxMoteur (U36.7), IA Core (MicroController1.45)
NetMicroController1_46: CarteTxMoteur (U36.1), IA Core (MicroController1.46)
NetMicroController1_58: IA Core (MicroController1.58), LED Matrix connector (To_LED_Matrix1.5)
NetMicroController1_59: IA Core (MicroController1.59), LED Matrix connector (To_LED_Matrix1.4)
NetMicroController1_60: IA Core (MicroController1.60), LED Matrix connector (To_LED_Matrix1.3)
NetMicroController1_74: IA Core (MicroController1.74), TXRobot-Boutons (P1.7)
NetMicroController1_75: IA Core (MicroController1.75), TXRobot-Boutons (P1.9)
NetMicroController1_76: IA Core (MicroController1.76), TXRobot-Boutons (P1.5)
NetMicroController1_77: IA Core (MicroController1.77), TXRobot-Boutons (P1.3)
NetMicroController1_78: IA Core (MicroController1.78), TXRobot-Boutons (P1.1)
NetMicroController1_82: CarteTxCapteurDistance 2 (R28.1 U22.gndReceiver), IA Core (MicroController1.82)
NetMicroController1_83: CarteTxCapteurDistance 2 (R27.1 U21.gndReceiver), IA Core (MicroController1.83)